# EasyEDA Pro project stm32f401rct6v1.eprj, schematic STM32F401RCT6
Create Date: 2023-12-03; Page Name: STM32F401RCT6; Project Name: stm32f401rct6v1; Schematic Name: STM32F401RCT6; Update Date: 2024-02-05; Company: 嘉立创EDA; Page Size: A4; Version: V1.0
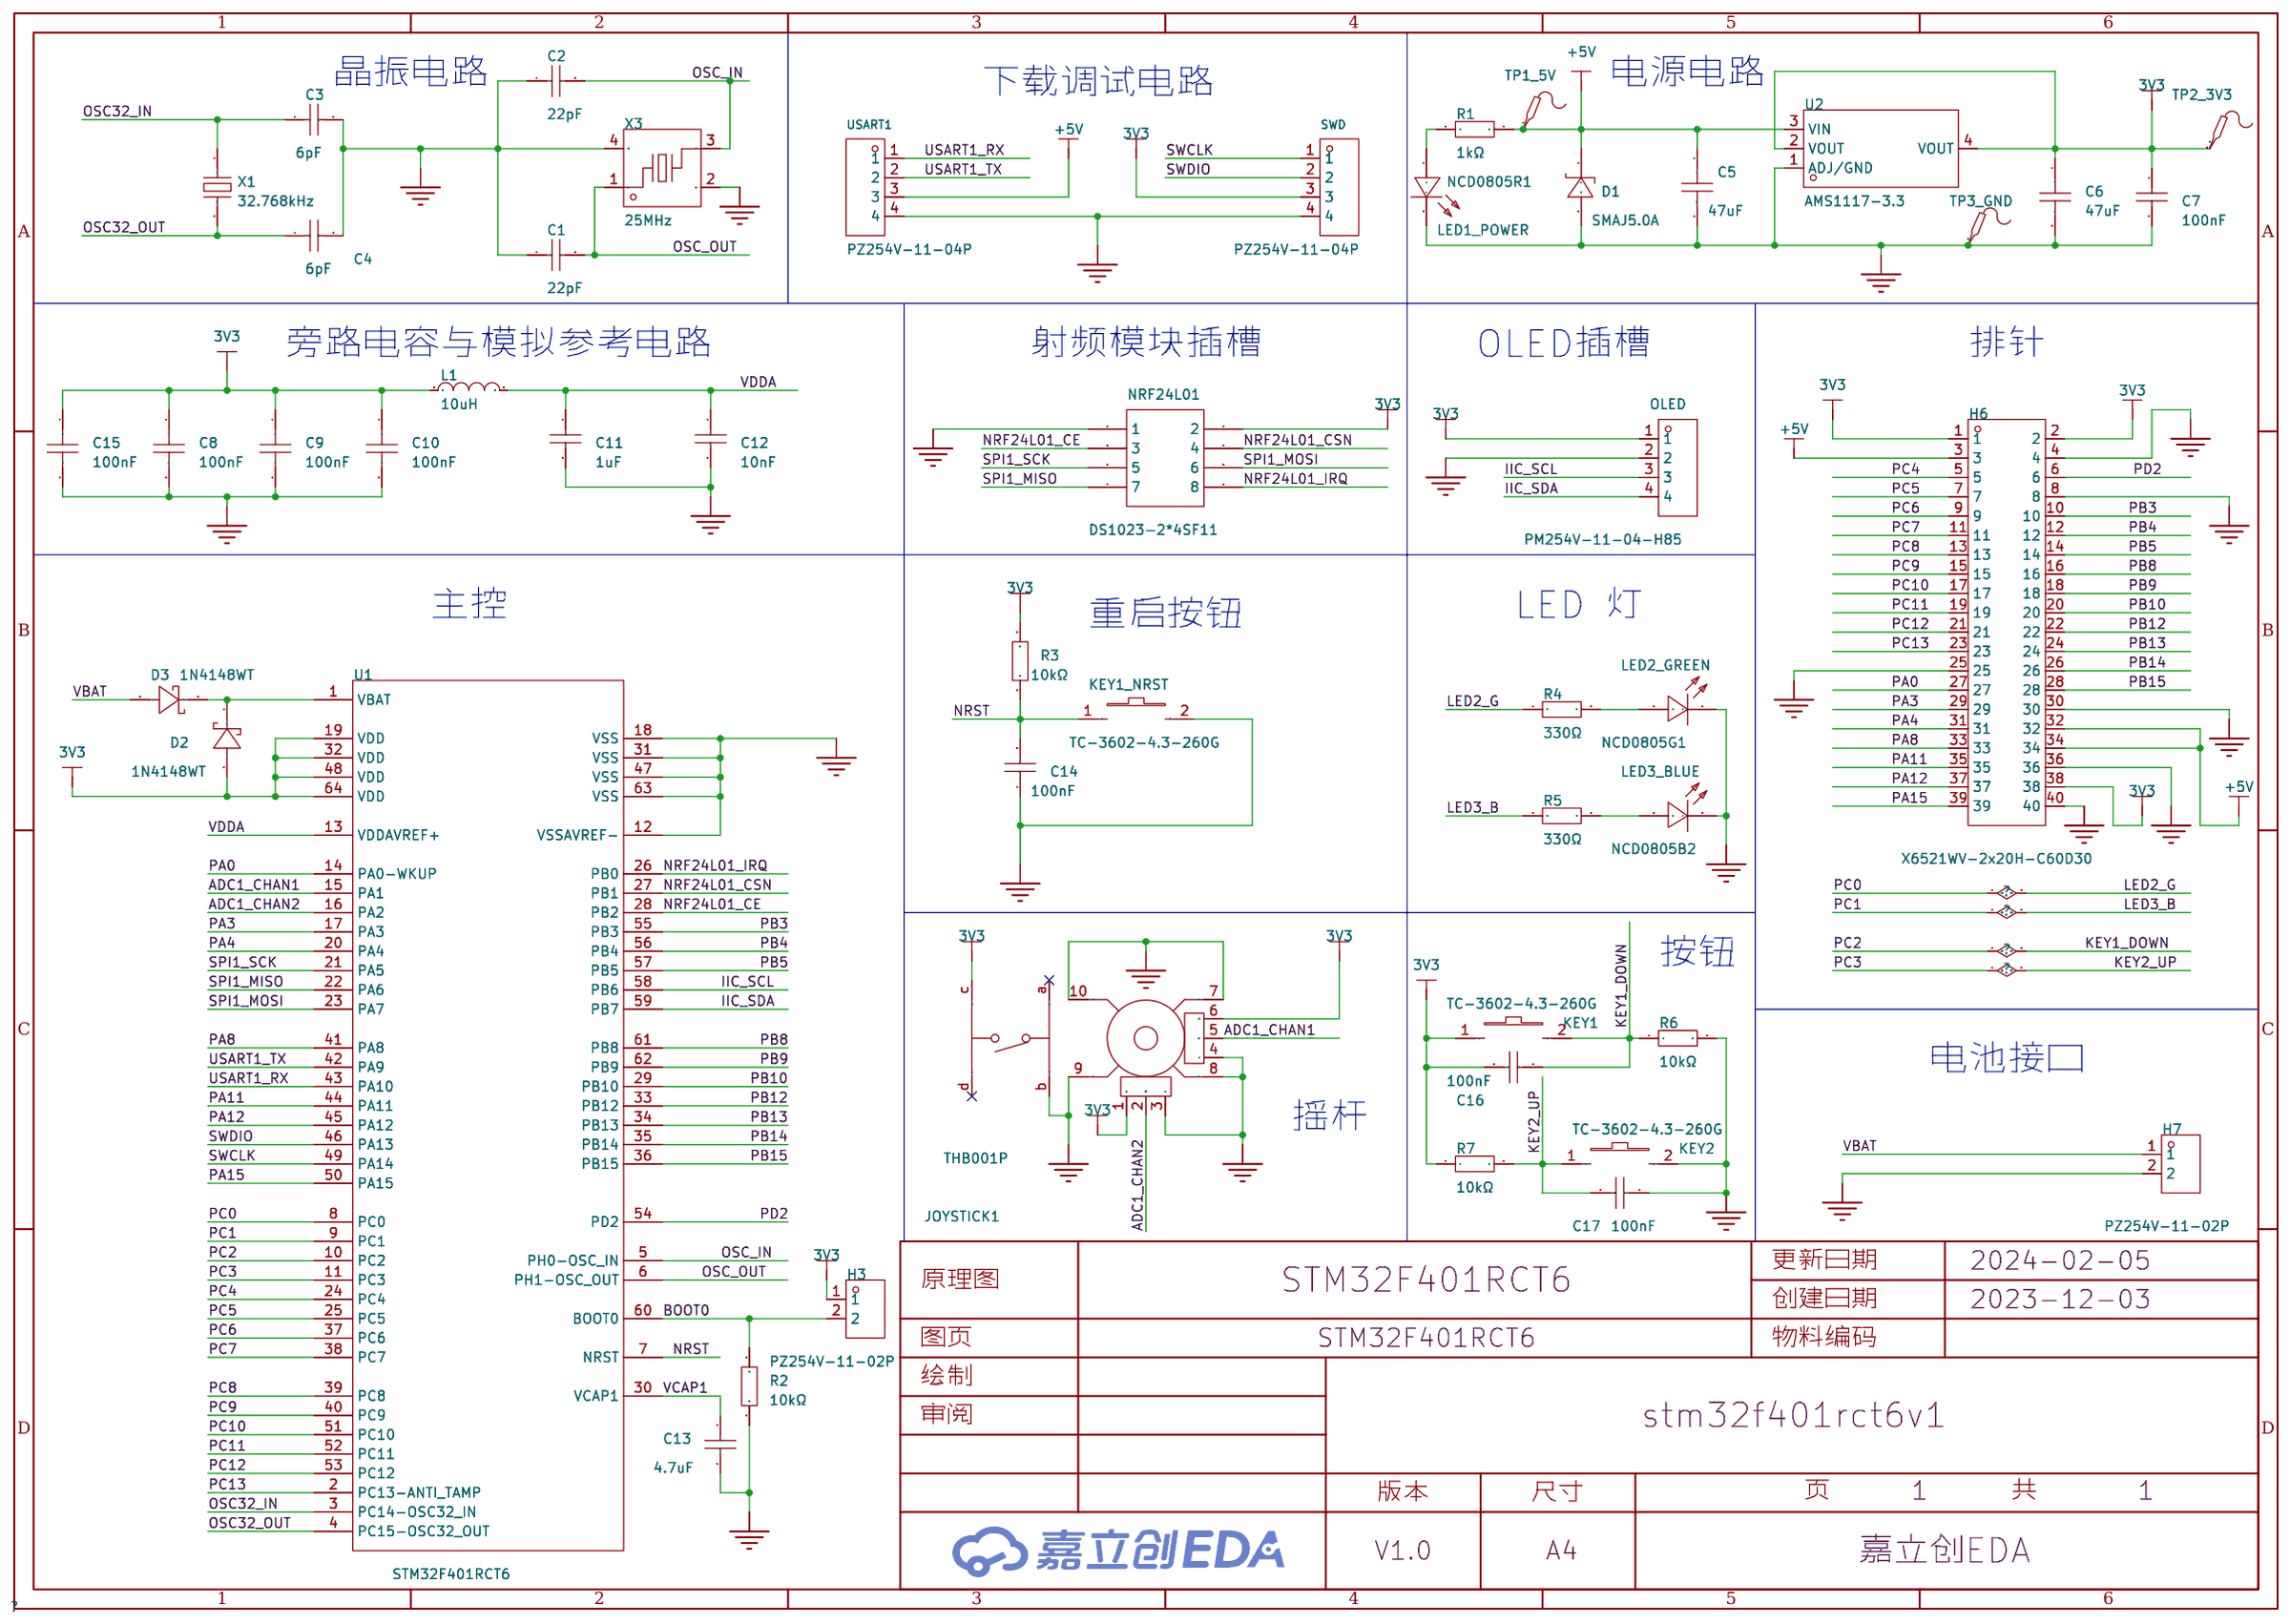
[diagram p0: schematic sheet]

## Parts
C1  22pF  [C0603]
C2  22pF  [C0603]
C3  6pF  [C0603]
C4  6pF  [C0603]
C5  47uF  [C1206]
C6  47uF  [C1206]
C7  100nF  [C1206]
C8  100nF  [C0603]
C9  100nF  [C0603]
C10  100nF  [C0603]
C11  1uF  [C0603]
C12  10nF  [C0603]
C13  4.7uF  [C0603]
C14  100nF  [C0603]
C15  100nF  [C0603]
C16  100nF  [C0603]
C17  100nF  [C0603]
D1  SMAJ5.0A  [SMA_L4.3-W2.6-LS5.2-RD]
D2  1N4148WT  [SOD-523_L1.2-W0.8-LS1.6-RD]
D3  1N4148WT  [SOD-523_L1.2-W0.8-LS1.6-RD]
H3  PZ254V-11-02P  [HDR-TH_2P-P2.54-V-M]
H6  X6521WV-2x20H-C60D30  [HDR-TH_40P-2.54-V-M-R2-C20-S2.54]
H7  PZ254V-11-02P  [HDR-TH_2P-P2.54-V-M]
JOYSTICK1  THB001P  [SW-TH_THB001P]
KEY1  TC-3602-4.3-260G  [KEY-SMD_L6.0-W3.6-LS8.3-L]
KEY1_NRST  TC-3602-4.3-260G  [KEY-SMD_L6.0-W3.6-LS8.3-L]
KEY2  TC-3602-4.3-260G  [KEY-SMD_L6.0-W3.6-LS8.3-L]
L1  10uH  [L0805]
LED1_POWER  NCD0805R1  [LED0805-R-RD]
LED2_GREEN  NCD0805G1  [LED0805-R-RD]
LED3_BLUE  NCD0805B2  [LED0805-R-RD]
NRF24L01  DS1023-2*4SF11  [HDR-TH_8P-P2.54-V-F-R2-C4-S2.54]
OLED  PM254V-11-04-H85  [HDR-TH_4P-P2.54-V-F]
R1  1kΩ  [R0603]
R2  10kΩ  [R0603]
R3  10kΩ  [R0603]
R4  330Ω  [R0603]
R5  330Ω  [R0603]
R6  10kΩ  [R0603]
R7  10kΩ  [R0603]
SWD  PZ254V-11-04P  [HDR-TH_4P-P2.54-V-M]
TP1_5V  -  [Test-Point-0.5mm]
TP2_3V3  -  [Test-Point-0.5mm]
TP3_GND  -  [Test-Point-0.5mm]
U1  STM32F401RCT6  [LQFP-64_L10.0-W10.0-P0.50-LS12.0-BL]
U2  AMS1117-3.3  [SOT-223_L6.5-W3.5-P2.30-LS7.0-BR]
USART1  PZ254V-11-04P  [HDR-TH_4P-P2.54-V-M]
X1  32.768kHz  [OSC-SMD_L3.2-W1.5]
X3  25MHz  [CRYSTAL-SMD_4P-L3.2-W2.5-BL]

## Library data of the parts
C1 C2 = CC0603JRNPO9BN220: 容值:22pF;精度:±5%;额定电压:50V;材质(温度系数):NP0;; LCSC Part Name: 22pF ±5% 50V; Supplier Part: C105620; Manufacturer: YAGEO(国巨); Supplier Footprint: 0603; JLCPCB Part Class: 扩展库; Datasheet: https://atta.szlcsc.com/upload/public/pdf/source/20170505/1493957838062.pdf; Supplier: LCSC; Tolerance: ±5%; Voltage Rated: 50V; Temperature Coefficient: NP0
C3 C4 = 0603CG6R0C500NT: 容值:6pF;额定电压:50V;材质(温度系数):C0G;; LCSC Part Name: 6pF 50V ±0.25pF; Supplier Part: C37474; Manufacturer: FH(风华); Supplier Footprint: 0603; JLCPCB Part Class: 扩展库; Datasheet: https://atta.szlcsc.com/upload/public/pdf/source/20200305/C486355_26A10D38EF8C2A5C37091D0039909270.pdf; Supplier: LCSC; Voltage Rated: 50V; Temperature Coefficient: C0G
C5 C6 = GRM31CR61E476ME44L: 容值:47uF;精度:±20%;额定电压:25V;材质(温度系数):X5R;; LCSC Part Name: 47uF ±20% 25V; Supplier Part: C403725; Manufacturer: muRata(村田); Supplier Footprint: 1206; JLCPCB Part Class: 扩展库; Datasheet: https://atta.szlcsc.com/upload/public/pdf/source/20191025/C403725_B8A8CD2FFA1F57E6FDF268BD106459D5.pdf; Supplier: LCSC; Tolerance: ±20%; Voltage Rated: 25V; Temperature Coefficient: X5R
C7 = CL31B104KBCNNNC: 容值:100nF;精度:±10%;额定电压:50V;材质(温度系数):X7R;; LCSC Part Name: 100nF ±10% 50V; Supplier Part: C24497; Manufacturer: SAMSUNG(三星); Supplier Footprint: 1206; JLCPCB Part Class: 基础库; Datasheet: https://atta.szlcsc.com/upload/public/pdf/source/20160218/1457707763339.pdf; Supplier: LCSC; Tolerance: ±10%; Voltage Rated: 50V; Temperature Coefficient: X7R
C8-C10 C15 = CC0603KRX7R9BB104: 容值:100nF;精度:±10%;额定电压:50V;材质(温度系数):X7R;; LCSC Part Name: 100nF ±10% 50V; Supplier Part: C14663; Manufacturer: YAGEO(国巨); Supplier Footprint: 0603; JLCPCB Part Class: 基础库; Datasheet: https://atta.szlcsc.com/upload/public/pdf/source/20180910/C282072_33301C7F631E79921B82A8DAC6BCC5B3.pdf; Supplier: LCSC; Tolerance: ±10%; Voltage Rated: 50V; Temperature Coefficient: X7R
C11 = CL10A105KB8NNNC: 容值:1uF;精度:±10%;额定电压:50V;材质(温度系数):X5R;; LCSC Part Name: 1uF ±10% 50V; Supplier Part: C15849; Manufacturer: SAMSUNG(三星); Supplier Footprint: 0603; JLCPCB Part Class: 基础库; Datasheet: https://atta.szlcsc.com/upload/public/pdf/source/20160218/1457707763339.pdf; Supplier: LCSC; Tolerance: ±10%; Voltage Rated: 50V; Temperature Coefficient: X5R
C12 = CC0603KRX7R9BB103: 容值:10nF;精度:±10%;额定电压:50V;材质(温度系数):X7R;; LCSC Part Name: 10nF ±10% 50V; Supplier Part: C100042; Manufacturer: YAGEO(国巨); Supplier Footprint: 0603; JLCPCB Part Class: 扩展库; Datasheet: https://atta.szlcsc.com/upload/public/pdf/source/20181008/C309510_22F155564471FAF6A489F7D68F34234E.pdf; Supplier: LCSC; Tolerance: ±10%; Voltage Rated: 50V; Temperature Coefficient: X7R
C13 = CL10A475KO8NNNC: 容值:4.7uF;精度:±10%;额定电压:16V;材质(温度系数):X5R;; LCSC Part Name: 4.7uF ±10% 16V; Supplier Part: C19666; Manufacturer: SAMSUNG(三星); Supplier Footprint: 0603; JLCPCB Part Class: 基础库; Datasheet: https://atta.szlcsc.com/upload/public/pdf/source/20160218/1457707763339.pdf; Supplier: LCSC; Tolerance: ±10%; Voltage Rated: 16V; Temperature Coefficient: X5R
C14 C16 C17 = 0603B104K500NT: 容值:100nF;精度:±10%;额定电压:50V;材质(温度系数):X7R;; LCSC Part Name: 100nF ±10% 50V; Supplier Part: C30926; Manufacturer: FH(风华); Supplier Footprint: 0603; JLCPCB Part Class: 扩展库; Datasheet: https://atta.szlcsc.com/upload/public/pdf/source/20200305/C486355_26A10D38EF8C2A5C37091D0039909270.pdf; Supplier: LCSC; Tolerance: ±10%; Voltage Rated: 50V; Temperature Coefficient: X7R
D1 = SMAJ5.0A_C10758: 反向截止电压(Vrwm):5V;最大钳位电压:9.2V;峰值脉冲电流(Ipp)@10/1000us:43.5A;击穿电压:6.4V;; LCSC Part Name: 单向TVS 5V截止 43.5A峰值脉冲; Supplier Part: C10758; Manufacturer: RUILON(瑞隆源); Supplier Footprint: SMA(DO-214AC); JLCPCB Part Class: 扩展库; Datasheet: https://atta.szlcsc.com/upload/public/pdf/source/20180711/C81281_95CC36DD15828E233F5FA92369DBC9C5.pdf; Supplier: LCSC; Reverse Stand-Off Voltage (Vrwm): 5V; Maximum Clamping Voltage: 9.2V; Peak Pulse Current (Ipp)@10/1000us: 43.5A; Breakdown Voltage: 6.4V; Type: TVS
D2 D3 = 1N4148WT_C727112: 二极管配置:独立式;正向压降(Vf):1.25V@150mA;直流反向耐压(Vr):75V;平均整流电流(Io):100mA;功率:150mW;反向恢复时间(trr):4ns;; LCSC Part Name: 电压:75V 电流:100mA; Supplier Part: C727112; Manufacturer: TWGMC(台湾迪嘉); Supplier Footprint: SOD-523; JLCPCB Part Class: 扩展库; Datasheet: https://atta.szlcsc.com/upload/public/pdf/source/20200828/C727112_FCA71CBB186A515518FBD85DA79D41CF.pdf; Supplier: LCSC; Diode Configuration: 独立式; Forward Voltage (Vf@If): 1.25V@150mA; Reverse Voltage (Vr): 75V; Average Rectified Current (Io): 100mA; Power Dissipation: 150mW; Reverse Leakage Current: 1uA@75V; Reverse Recovery Time (trr): 4ns; Operating Temperature: -65℃~+150℃@(Tj)
H3 H7 = PZ254V-11-02P: 插针结构:1x2P;间距:2.54mm;行距:-;圆针/方针:方针;安装类型:直插;排数:单排;总PIN位数:2P;额定电流:-;额定电压:-;配合针长度:6mm;塑高:2.5mm;端接针长度:3mm;触头材质:黄铜;触头镀层:-;工作温度范围:-40℃~+105℃;颜色:黑色;; LCSC Part Name: 间距:2.54mm 1x2P 直插 方针; Supplier Part: C492401; Manufacturer: XFCN(兴飞); Supplier Footprint: 插件,P=2.54mm; JLCPCB Part Class: 扩展库; Datasheet: https://atta.szlcsc.com/upload/public/pdf/source/20200309/C492401_A812433581A9B211A7FFA413ADDFF0E5.pdf; Supplier: LCSC; Pin Structure: 1x2P; Pitch: 2.54mm; Circluar Pins/Square Pins: 方针; Mounting Type: 直插; Number of Rows: 单排; Number of Pins: 2P; Length of Mating Pin: 6mm; Insulation Height: 2.5mm; Length of End Connection Pin: 3mm; Contact Material: 黄铜; Operating Temperature Range: -40℃~+105℃; Color: 黑色
H6 = X6521WV-2x20H-C60D30: 插针结构:2x20P;间距:2.54mm;行距:2.54mm;圆针/方针:方针;安装类型:直插;排数:双排;总PIN位数:40P;额定电流:3A;额定电压:250V;配合针长度:6mm;塑高:2.5mm;端接针长度:3mm;触头材质:黄铜;触头镀层:金;工作温度范围:-40℃~+105℃;焊接温度(最大值):260℃;颜色:黑色;; LCSC Part Name: 间距:2.54mm 2x20P 直插 方针; Supplier Part: C725892; Manufacturer: XKB Connectivity(中国星坤); Supplier Footprint: 插件,P=2.54mm; JLCPCB Part Class: 扩展库; Supplier: LCSC; Pin Structure: 2x20P; Pitch: 2.54mm; Row Spacing: 2.54mm; Circluar Pins/Square Pins: 方针; Mounting Type: 直插; Number of Rows: 双排; Number of Pins: 40P; Current Rating (Max): 3A; Voltage Rating (Max): 250V; Length of Mating Pin: 6mm; Insulation Height: 2.5mm; Length of End Connection Pin: 3mm; Contact Material: 黄铜; Contact Plating: 金; Operating Temperature Range: -40℃~+105℃; Welding Temperature (Max): 260℃; Color: 黑色
JOYSTICK1 = THB001P: 带有多功能, 高质量的双轴杠杆和集成的中心选择开关 适用于航模玩具遥控器电位器、3D摇杆PS4手柄游戏机、无人机摇杆电位器、工业控制器; LCSC Part Name: 微型指拨摇杆开关; Supplier Part: C2685355; Manufacturer: C&K; Supplier Footprint: 插件-14P,17x21mm; JLCPCB Part Class: 扩展库; Datasheet: https://atta.szlcsc.com/upload/public/pdf/source/20210114/C2685355_98E98C84804317E8B305B6FAD3A93D12.pdf; Supplier: LCSC
KEY1 KEY1_NRST KEY2 = TC-3602-4.3-260G_C3012022: 电路结构:单刀单掷;带支架:否;触点电流:50mA;额定电压(AC):-;额定电压(DC):12V;额定功率:-;安装方式:立贴;绝缘电阻:-;带灯:无;作用力:260gf;机械寿命:10万次;; LCSC Part Name: 3*6*4.3mm 立贴 轻触开关; Supplier Part: C3012022; Manufacturer: HCTL(华灿天禄); Supplier Footprint: SMD; JLCPCB Part Class: 扩展库; Datasheet: https://atta.szlcsc.com/upload/public/pdf/source/20210730/C2845293_5277CDF8C59032B794BE536E6FDEACDD.pdf; Supplier: LCSC; Circuit: 单刀单掷; Actuator Style: 圆形按钮; Switch Length: 3mm; Switch Width: 6mm; Switch Height: 4.3mm; Strike Gundam: 否; Contact Current: 50mA; Voltage Rating (DC): 12V; Mounting Style: 立贴; Actuator/Cap Color: 白色; With Lamp: 无; Operating Force: 260gf; Mechanical Life: 10万次; Operating Temperature: -30℃~+85℃
L1 = SLM2012100MIT: 电感值:10uH;精度:±20%;额定电流:360mA;饱和电流(Isat):-;; LCSC Part Name: 10uH ±20%; Supplier Part: C2831365; Manufacturer: Sunltech(韩国顺磁); Supplier Footprint: 0805; JLCPCB Part Class: 扩展库; Datasheet: https://atta.szlcsc.com/upload/public/pdf/source/20180528/C216156_746607D01E5EB4C50E0D2BE40685D2FE.pdf; Supplier: LCSC; Tolerance: ±20%; Rated Current: 360mA; DC Resistance (DCR): 550mΩ
LED1_POWER = NCD0805R1: 灯头类型:-;发光颜色:红色;正向电压(VF):1.6V~2.6V;功率:65mW;正向电流:20mA;主波长:615nm~630nm;二极管配置:独立二极管;透镜颜色:无色透明;色温:-;发光强度:67mcd~195mcd;发光角度:130°;载带方式:-;工作温度:-30℃~+85℃;; Supplier Part: C84256; Manufacturer: 国星光电; Supplier Footprint: 0805; JLCPCB Part Class: 基础库; Datasheet: https://atta.szlcsc.com/upload/public/pdf/source/20200820/C84256_F0A75A43B3EAD75808600A0514C76B99.pdf; Supplier: LCSC; Emitted Color: 红色; Forward Voltage (VF): 1.6V~2.6V; Power Dissipation: 65mW; Forward Current: 20mA; Dominant Wavelength: 615nm~630nm; Diode Configuration: 独立二极管; Lens Color: 无色透明; Luminous Intensity: 67mcd~195mcd; Viewing Angle: 130°; Operating Temperature: -30℃~+85℃
LED2_GREEN = NCD0805G1: 发光颜色:翠绿色;正向电压(VF):2.5V~3.6V;功率:72mW;正向电流:5mA;主波长:525nm~537.5nm;透镜颜色:无色透明;发光强度:180mcd~400mcd;发光角度:130°;工作温度:-30℃~+85℃;; Supplier Part: C84260; Manufacturer: 国星光电; Supplier Footprint: 0805; JLCPCB Part Class: 扩展库; Datasheet: https://atta.szlcsc.com/upload/public/pdf/source/20200820/C84260_AFC7BF57C6FBA034D182BB8D10A67EFE.pdf; Supplier: LCSC; Emitted Color: 翠绿色; Forward Voltage (VF): 2.5V~3.6V; Power Dissipation: 72mW; Forward Current: 5mA; Dominant Wavelength: 525nm~537.5nm; Lens Color: 无色透明; Luminous Intensity: 180mcd~400mcd; Viewing Angle: 130°; Operating Temperature: -30℃~+85℃
LED3_BLUE = NCD0805B2: 发光颜色:蓝色;正向电压(VF):2.5V~3.6V;功率:72mW;正向电流:2mA;主波长:468nm~478nm;透镜颜色:无色透明;发光强度:20mcd~55mcd;发光角度:130°;工作温度:-30℃~+85℃;; Supplier Part: C84259; Manufacturer: 国星光电; Supplier Footprint: 0805; JLCPCB Part Class: 扩展库; Datasheet: https://atta.szlcsc.com/upload/public/pdf/source/20200820/C84259_E5AC6865415989C4C2C2831134BA3A23.pdf; Supplier: LCSC; Emitted Color: 蓝色; Forward Voltage (VF): 2.5V~3.6V; Power Dissipation: 72mW; Forward Current: 2mA; Dominant Wavelength: 468nm~478nm; Lens Color: 无色透明; Luminous Intensity: 20mcd~55mcd; Viewing Angle: 130°; Operating Temperature: -30℃~+85℃
NRF24L01 = DS1023-2*4SF11: 插孔结构:2x4P;间距:2.54mm;行距:2.54mm;安装类型:直插;排数:双排;总孔位数:8P;塑高:-;触头材质:-;触头镀层:-;; LCSC Part Name: 间距:2.54mm 2x4P 直插 黑色; Supplier Part: C92271; Manufacturer: CONNFLY; Supplier Footprint: 插件,P=2.54mm; JLCPCB Part Class: 扩展库; Datasheet: https://atta.szlcsc.com/upload/public/pdf/source/20170925/C132132_1506321659018990428.pdf; Supplier: LCSC; Holes Structure: 2x4P; Pitch: 2.54mm; Row Spacing: 2.54mm; Mounting Type: 直插; Number of Rows: 双排; Number of Holes: 8P
OLED = PM254V-11-04-H85: 插孔结构:1x4P;间距:2.54mm;行距:-;安装类型:直插;排数:单排;总孔位数:4P;塑高:-;触头材质:黄铜;触头镀层:-;; LCSC Part Name: 间距:2.54mm 1x4P 直插; Supplier Part: C541851; Manufacturer: XFCN(兴飞); Supplier Footprint: 插件,P=2.54mm; JLCPCB Part Class: 扩展库; Datasheet: https://atta.szlcsc.com/upload/public/pdf/source/20200518/C541849_85853D71FC67C51915A806977A588FDA.pdf; Supplier: LCSC; Holes Structure: 1x4P; Pitch: 2.54mm; Mounting Type: 直插; Number of Rows: 单排; Number of Holes: 4P; Contact Material: 黄铜
R1 = RC0603FR-071KL: 电阻类型:厚膜电阻;阻值:1kΩ;精度:±1%;功率:100mW;; LCSC Part Name: 1kΩ ±1% 100mW; Supplier Part: C22548; Manufacturer: YAGEO(国巨); Supplier Footprint: 0603; JLCPCB Part Class: 扩展库; Datasheet: https://atta.szlcsc.com/upload/public/pdf/source/20180312/7BD3618A8B6324EA6280B0497A051AB7.pdf; Supplier: LCSC; Type: 厚膜电阻; Tolerance: ±1%; Power(Watts): 100mW; Temperature Coefficient: ±100ppm/℃; Overload Voltage (Max): 75V; Operating Temperature Range: -55℃~+155℃
R2 R3 R6 R7 = 0603WAF1002T5E: 电阻类型:厚膜电阻;阻值:10kΩ;精度:±1%;功率:100mW;最大工作电压:75V;温度系数:±100ppm/℃;; LCSC Part Name: 10kΩ ±1% 100mW 厚膜电阻; Supplier Part: C25804; Manufacturer: UNI-ROYAL(厚声); Supplier Footprint: 0603; JLCPCB Part Class: 基础库; Datasheet: https://atta.szlcsc.com/upload/public/pdf/source/20200306/C422600_1E6D84923E4A46A82E41ADD87F860B5C.pdf; Supplier: LCSC; Type: 厚膜电阻; Tolerance: ±1%; Power(Watts): 100mW; Overload Voltage (Max): 75V; Temperature Coefficient: ±100ppm/℃; Operating Temperature Range: -55℃~+155℃
R4 R5 = 0603WAF3300T5E: 阻值:330Ω;精度:±1%;功率:100mW;温度系数:±100ppm/℃;电阻类型:厚膜电阻;; LCSC Part Name: 330Ω ±1% 100mW 厚膜电阻; Supplier Part: C23138; Manufacturer: UNI-ROYAL(厚声); Supplier Footprint: 0603; JLCPCB Part Class: 基础库; Datasheet: https://atta.szlcsc.com/upload/public/pdf/source/20200306/C422600_1E6D84923E4A46A82E41ADD87F860B5C.pdf; Supplier: LCSC; Tolerance: ±1%; Power(Watts): 100mW; Overload Voltage (Max): 75V; Temperature Coefficient: ±100ppm/℃; Type: 厚膜电阻; Operating Temperature Range: -55℃~+155℃
SWD USART1 = PZ254V-11-04P: 排数:单排;总PIN位数:4P;间距:2.54mm;插针结构:1x4P;行距:-;安装类型:直插;圆针/方针:方针;额定电流:3A;额定电压:250V;配合针长度:6mm;塑高:2.5mm;端接针长度:3mm;触头材质:-;工作温度范围:-40℃~+105℃;颜色:黑色;; LCSC Part Name: 2.54mm 1x4P 直插 方针; Supplier Part: C2691448; Manufacturer: XFCN(兴飞); Supplier Footprint: 插件,P=2.54mm; JLCPCB Part Class: 扩展库; Datasheet: https://atta.szlcsc.com/upload/public/pdf/source/20200309/C492403_F9F19131791D08044AD4F84F8E751A34.pdf; Supplier: LCSC; Number of Rows: 单排; Number of Pins: 4P; Pitch: 2.54mm; Pin Structure: 1x4P; Mounting Type: 直插; Circluar Pins/Square Pins: 方针; Current Rating (Max): 3A; Voltage Rating (Max): 250V; Length of Mating Pin: 6mm; Insulation Height: 2.5mm; Length of End Connection Pin: 3mm; Operating Temperature Range: -40℃~+105℃; Color: 黑色
TP1_5V TP2_3V3 TP3_GND = Test-Point: Test Point 测试点
U1 = STM32F401RCT6: CPU内核:ARM Cortex-M4;CPU最大主频:84MHz;工作电压范围:1.7V~3.6V;程序存储容量:256KB;程序存储器类型:FLASH;RAM总容量:64KB;GPIO端口数量:50;; Supplier Part: C74524; Manufacturer: ST(意法半导体); Supplier Footprint: LQFP-64(10x10); JLCPCB Part Class: 扩展库; Datasheet: https://atta.szlcsc.com/upload/public/pdf/source/20170712/C118825_1499827770838813456.pdf; Supplier: LCSC; CPU Core: ARM Cortex-M4; CPU Maximum Speed: 84MHz; Operating Voltage Range: 1.7V~3.6V; Program Storage Size: 256KB; Program Memory Type: FLASH; RAM Size: 64KB; GPIO Ports Number: 50; ADC (Bit): 12bit; Universal Serial Bus: 有; Peripheral/Function: PWM；PWM; Watchdog: 有; Infrared Data Association: 有; Low-Voltage Detect: 有; Secure Digital Input and Output: 有; Direct Memory Access: 有; Internal Oscillator: 有; Operating Temperature Range: -40℃~+85℃
U2 = AMS1117-3.3_C426566: 输出类型:固定;最大输入电压:18V;输出电压:3.3V;输出电流:1A;电源纹波抑制比(PSRR):70dB@(120Hz);输出极性:正;; LCSC Part Name: 输入18V 输出3.3V 1A; Supplier Part: C426566; Manufacturer: Slkor(萨科微); Supplier Footprint: SOT-223; JLCPCB Part Class: 扩展库; Datasheet: https://atta.szlcsc.com/upload/public/pdf/source/20201231/C426566_7F22DB93439D00F3FA27143E4F28C6AA.pdf; Supplier: LCSC; Output Type: 固定; Maximum Input Voltage: 18V; Output Voltage: 3.3V; Output Current: 1A; Power Supply Rejection Ratio (PSRR): 70dB@(120Hz); Dropout Voltage: 1.4V@(1A); Output Polarity: 正; Number of Outputs: 1
X1 = X321532768KGD2SI: 频率:32.768kHz;负载电容:12.5pF;频率公差:±20ppm;; LCSC Part Name: 32.768kHz ±20ppm 12.5pF YST310S; Supplier Part: C620155; Manufacturer: YXC(扬兴晶振); Supplier Footprint: SMD3215-2P; JLCPCB Part Class: 扩展库; Datasheet: https://atta.szlcsc.com/upload/public/pdf/source/20210329/C620155_E5A74FC0D27C5E9015A8D75DE9484FEA.pdf; Supplier: LCSC; Crystal Type: 贴片无源晶振; Load Capacitance: 12.5pF; Frequency Tolerance: ±20ppm; Operating Temperature: -40℃~+85℃
X3 = XL2EL89CSI-111YLC-25M: 频率:25MHz;负载电容:20pF;频率公差:±10ppm;; LCSC Part Name: 25MHz ±10ppm 20pF YSX321SL; Supplier Part: C5280577; Manufacturer: YXC(扬兴晶振); Supplier Footprint: SMD3225-4P; JLCPCB Part Class: 扩展库; Datasheet: https://atta.szlcsc.com/upload/public/pdf/source/20221123/8DAA01809C4E3F159850A71277C18D74.pdf; Supplier: LCSC; Crystal Type: 贴片无源晶振; Load Capacitance: 20pF; Frequency Tolerance: ±10ppm

## Nets
3V3: C6.1 C7.1 C8.1 C9.1 C10.1 C15.1 C16.1 D2.2(A) H3.1 H6.1 H6.2 H6.38 JOYSTICK1.1(B) JOYSTICK1.6(B) JOYSTICK1.c KEY1.1 L1.1 NRF24L01.2 OLED.1 R3.2 R7.1 SWD.3 TP2_3V3.1 U1.19(VDD) U1.32(VDD) U1.48(VDD) U1.64(VDD) U2.2(VOUT) U2.4(VOUT)
+5V: C5.1 D1.1(K) H6.3 H6.32 H6.34 R1.1 TP1_5V.1 U2.3(VIN) USART1.3
GND: C1.1 C2.1 C3.2 C4.2 C5.2 C6.2 C7.2 C8.2 C9.2 C10.2 C11.2 C12.2 C13.2 C14.1 C15.2 C17.2 D1.2(A) H6.4 H6.8 H6.25 H6.30 H6.36 H6.40 H7.2 JOYSTICK1.3(A) JOYSTICK1.4(A) JOYSTICK1.7(GND) JOYSTICK1.8(GND) JOYSTICK1.9(GND) JOYSTICK1.10(GND) JOYSTICK1.b KEY1_NRST.2 KEY2.2 LED1_POWER.2(-) LED2_GREEN.2(K) LED3_BLUE.2(-) NRF24L01.1 OLED.2 R2.2 R6.2 SWD.4 TP3_GND.1 U1.12(VSSAVREF-) U1.18(VSS) U1.31(VSS) U1.47(VSS) U1.63(VSS) U2.1(ADJ/GND) USART1.4 X3.2(GND) X3.4(GND)
VBAT: D3.2(A) H7.1
VDDA: C11.1 C12.1 L1.2 U1.13(VDDAVREF+)
ADC1_CHAN1: JOYSTICK1.5(DTA) U1.15(PA1)
ADC1_CHAN2: JOYSTICK1.2(DTA) U1.16(PA2)
BOOT0: H3.2 R2.1 U1.60(BOOT0)
IIC_SCL: OLED.3 U1.58(PB6)
IIC_SDA: OLED.4 U1.59(PB7)
KEY1_DOWN: C16.2 KEY1.2 R6.1 U1.10(PC2)
KEY2_UP: C17.1 KEY2.1 R7.2 U1.11(PC3)
LED2_G: R4.1 U1.8(PC0)
LED3_B: R5.1 U1.9(PC1)
NRF24L01_CE: NRF24L01.3 U1.28(PB2)
NRF24L01_CSN: NRF24L01.4 U1.27(PB1)
NRF24L01_IRQ: NRF24L01.8 U1.26(PB0)
NRST: C14.2 KEY1_NRST.1 R3.1 U1.7(NRST)
OSC32_IN: C3.1 U1.3(PC14-OSC32_IN) X1.1
OSC32_OUT: C4.1 U1.4(PC15-OSC32_OUT) X1.2
OSC_IN: C2.2 U1.5(PH0-OSC_IN) X3.3
OSC_OUT: C1.2 U1.6(PH1-OSC_OUT) X3.1
PA0: H6.27 U1.14(PA0-WKUP)
PA3: H6.29 U1.17(PA3)
PA4: H6.31 U1.20(PA4)
PA8: H6.33 U1.41(PA8)
PA11: H6.35 U1.44(PA11)
PA12: H6.37 U1.45(PA12)
PA15: H6.39 U1.50(PA15)
PB3: H6.10 U1.55(PB3)
PB4: H6.12 U1.56(PB4)
PB5: H6.14 U1.57(PB5)
PB8: H6.16 U1.61(PB8)
PB9: H6.18 U1.62(PB9)
PB10: H6.20 U1.29(PB10)
PB12: H6.22 U1.33(PB12)
PB13: H6.24 U1.34(PB13)
PB14: H6.26 U1.35(PB14)
PB15: H6.28 U1.36(PB15)
PC4: H6.5 U1.24(PC4)
PC5: H6.7 U1.25(PC5)
PC6: H6.9 U1.37(PC6)
PC7: H6.11 U1.38(PC7)
PC8: H6.13 U1.39(PC8)
PC9: H6.15 U1.40(PC9)
PC10: H6.17 U1.51(PC10)
PC11: H6.19 U1.52(PC11)
PC12: H6.21 U1.53(PC12)
PC13: H6.23 U1.2(PC13-ANTI_TAMP)
PD2: H6.6 U1.54(PD2)
SPI1_MISO: NRF24L01.7 U1.22(PA6)
SPI1_MOSI: NRF24L01.6 U1.23(PA7)
SPI1_SCK: NRF24L01.5 U1.21(PA5)
SWCLK: SWD.1 U1.49(PA14)
SWDIO: SWD.2 U1.46(PA13)
USART1_RX: U1.43(PA10) USART1.1
USART1_TX: U1.42(PA9) USART1.2
VCAP1: C13.1 U1.30(VCAP1)
$1N3059: LED1_POWER.1(+) R1.2
$1N4213: D2.1(C) D3.1(C) U1.1(VBAT)
$1N8046: LED2_GREEN.1(A) R4.2
$1N8049: LED3_BLUE.1(+) R5.2

Not connected (* = marked no-connect by the designer): JOYSTICK1 a* d*

## Notes on the sheet
- 晶振电路
- 电源电路
- 下载调试电路
- 旁路电容与模拟参考电路
- 射频模块插槽
- OLED插槽
- 排针
- 主控
- 重启按钮
- LED 灯
- 按钮
- 电池接口
- 摇杆
